# Altium project Car Power Supply.PrjPcb
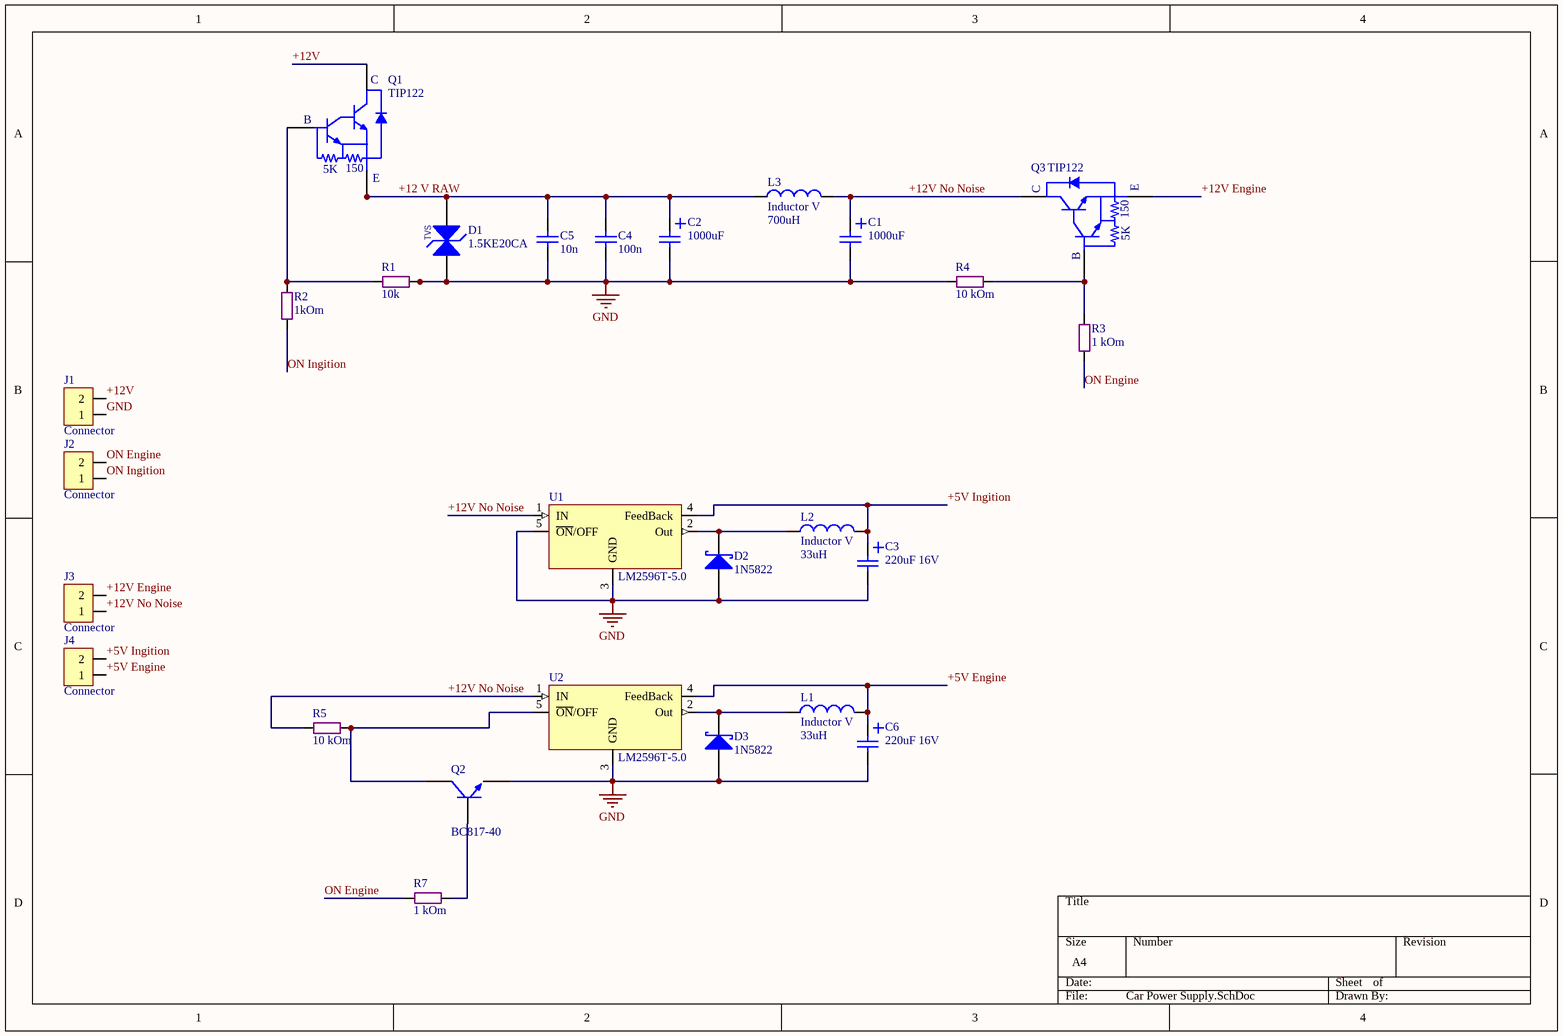
[diagram p0: Car Power Supply.SchDoc]
1 sheet, 27 parts. Net scope: global (net labels, ports and power ports of the same name join across sheets).
Board files: Car Power Supply.PcbDoc, Car Power Supply v2 compact.PcbDoc

## Sheet Car Power Supply.SchDoc
size A4

### Parts
C1  1000uF  [Cap E p5.08mm D10.2mm (3p)]
C2  1000uF  [Cap E p5.08mm D10.2mm (3p)]
C3  220uF 16V  [Cap E p2mm D6.5xH11]
C4  100n  [Cap P5.08MM (3p) disk2]
C5  10n  [Cap P5.08MM (3p) disk2]
C6  220uF 16V  [Cap E p2mm D6.5xH11]
D1  1.5KE20CA  [TVS diode DO-201 V]
D2  1N5822  [Diode DO-201]
D3  1N5822  [Diode DO-201 V]
J1  Connector  [DG301 5mm 2p]
J2  Connector  [DG301 5mm 2p]
J3  Connector  [DG301 5mm 2p]
J4  Connector  [DG301 5mm 2p]
L1  Inductor V  value 33uH  [Toroid V D14-W6]
L2  Inductor V  value 33uH  [Toroid V D14-W6]
L3  Inductor V  value 700uH  [Toroid V D14-W6]
Q1  TIP122  [TO220-2]
Q2  BC817-40  [SOT-23]
Q3  TIP122  [TO220-2]
R1  10k  [SMD 0805 (2012)]
R2  1kOm  [SMD 0805 (2012)]
R3  1 kOm  [Res p7.62 (4p) 0.25w]
R4  10 kOm  [SMD 0805 (2012)]
R5  10 kOm  [Res p7.62 (4p) 0.25w]
R7  1 kOm  [Res p7.62 (4p) 0.25w]
U1  LM2596T-5.0  [TO220-5 Vertical]
U2  LM2596T-5.0  [TO220-5 Vertical]

### Nets
GND: C1.2 C2.2 C3.2 C4.2 C5.2 C6.2 D1.1 D2.A D3.A J1.1 Q2.2(E) R1.2 R4.2 U1.3(GND) U1.5(~{ON}/OFF) U2.3(GND)
+5V Engine: C6.1 J4.1 L1.2 U2.4(FeedBack)
+5V Ingition: C3.1 J4.2 L2.2 U1.4(FeedBack)
+12 V RAW: C2.1 C4.1 C5.1 D1.2 L3.1 Q1.3(E)
+12V: J1.2 Q1.2(C)
+12V Engine: J3.2 Q3.3(E)
+12V No Noise: C1.1 J3.1 L3.2 Q3.2(C) R5.1 U1.1(IN) U2.1(IN)
ON Engine: J2.2 R3.1 R7.1
ON Ingition: J2.1 R2.1
NetD2_K: D2.K L2.1 U1.2(Out)
NetD3_K: D3.K L1.1 U2.2(Out)
NetQ1_1: Q1.1(B) R1.1 R2.2
NetQ2_1: Q2.1(B) R7.2
NetQ2_3: Q2.3(C) R5.2 U2.5(~{ON}/OFF)
NetQ3_1: Q3.1(B) R3.2 R4.1

### Notes on the sheet
- (in symbol TIP122) 5K; 150
- (in symbol TVS 1.5KE20CA) TVS

### Library data of the parts
C1 C2 = Cap E 1000mF x 25V: Capacitor
C3 C6 = Cap E 220mF x 16V: Capacitor; Value: 220mF 16v
C4 C5 = Cap Ceramic: Capacitor
D1 = TVS 1.5KE20CA: 1500W Transil (TVS Diode); Stand-Off V: 17.1; Load A: 5; Breakdown V: min 19 max 21; PackageReference: DO-201; Pulse Power: 1500W; VALUE: 1.5KE20CA
D2 D3 = D Shotki 1N5822: 3 Amp Shotki  Diode; PackageReference: DO-201; VALUE: 1N5822
J1-J4 = DG301-5.0-2P12: DG301 series
L1-L3 = Inductor V: Inductor Vertical; Code_IEC: 1005; Published: 8-Jun-2000; LatestRevisionDate: 29-May-2009; LatestRevisionNote: IPC-7351 Footprint Added.; PackageReference: 0402-A; Publisher: Altium Limited; PackageDescription: Chip Inductor; Code_JEITA: 0402
Q1 Q3 = TIP122: NPN Darlington 5A, 65W, 100V, h>1000; I imp: 8A; h21e: >1000; Code_JEDEC: TO-220; U max: 100V; I max: 5A; P max: 65W; Channnel: NPN
Q2 = BC817-40: NPN 45 V, 500 mA NPN general-purpose transistor; type: 45 V, 500 mA NPN general-purpose transistors; Name: BC817-40; url: http://lib.chipdip.ru/156/DOC000156781.pdf
R1 R2 R4 = Res SMD 0805
R3 R5 R7 = Res All Types
U1 U2 = LM2596T-5.0: Voltage Regulator; Manufacturer: National Semiconductor; I output (A): 3; Max Voltage In (V): 40; Name: LM2596T-5.0; Case: TO220-5